# EAGLE design nola6 (EAGLE 8.7.1)
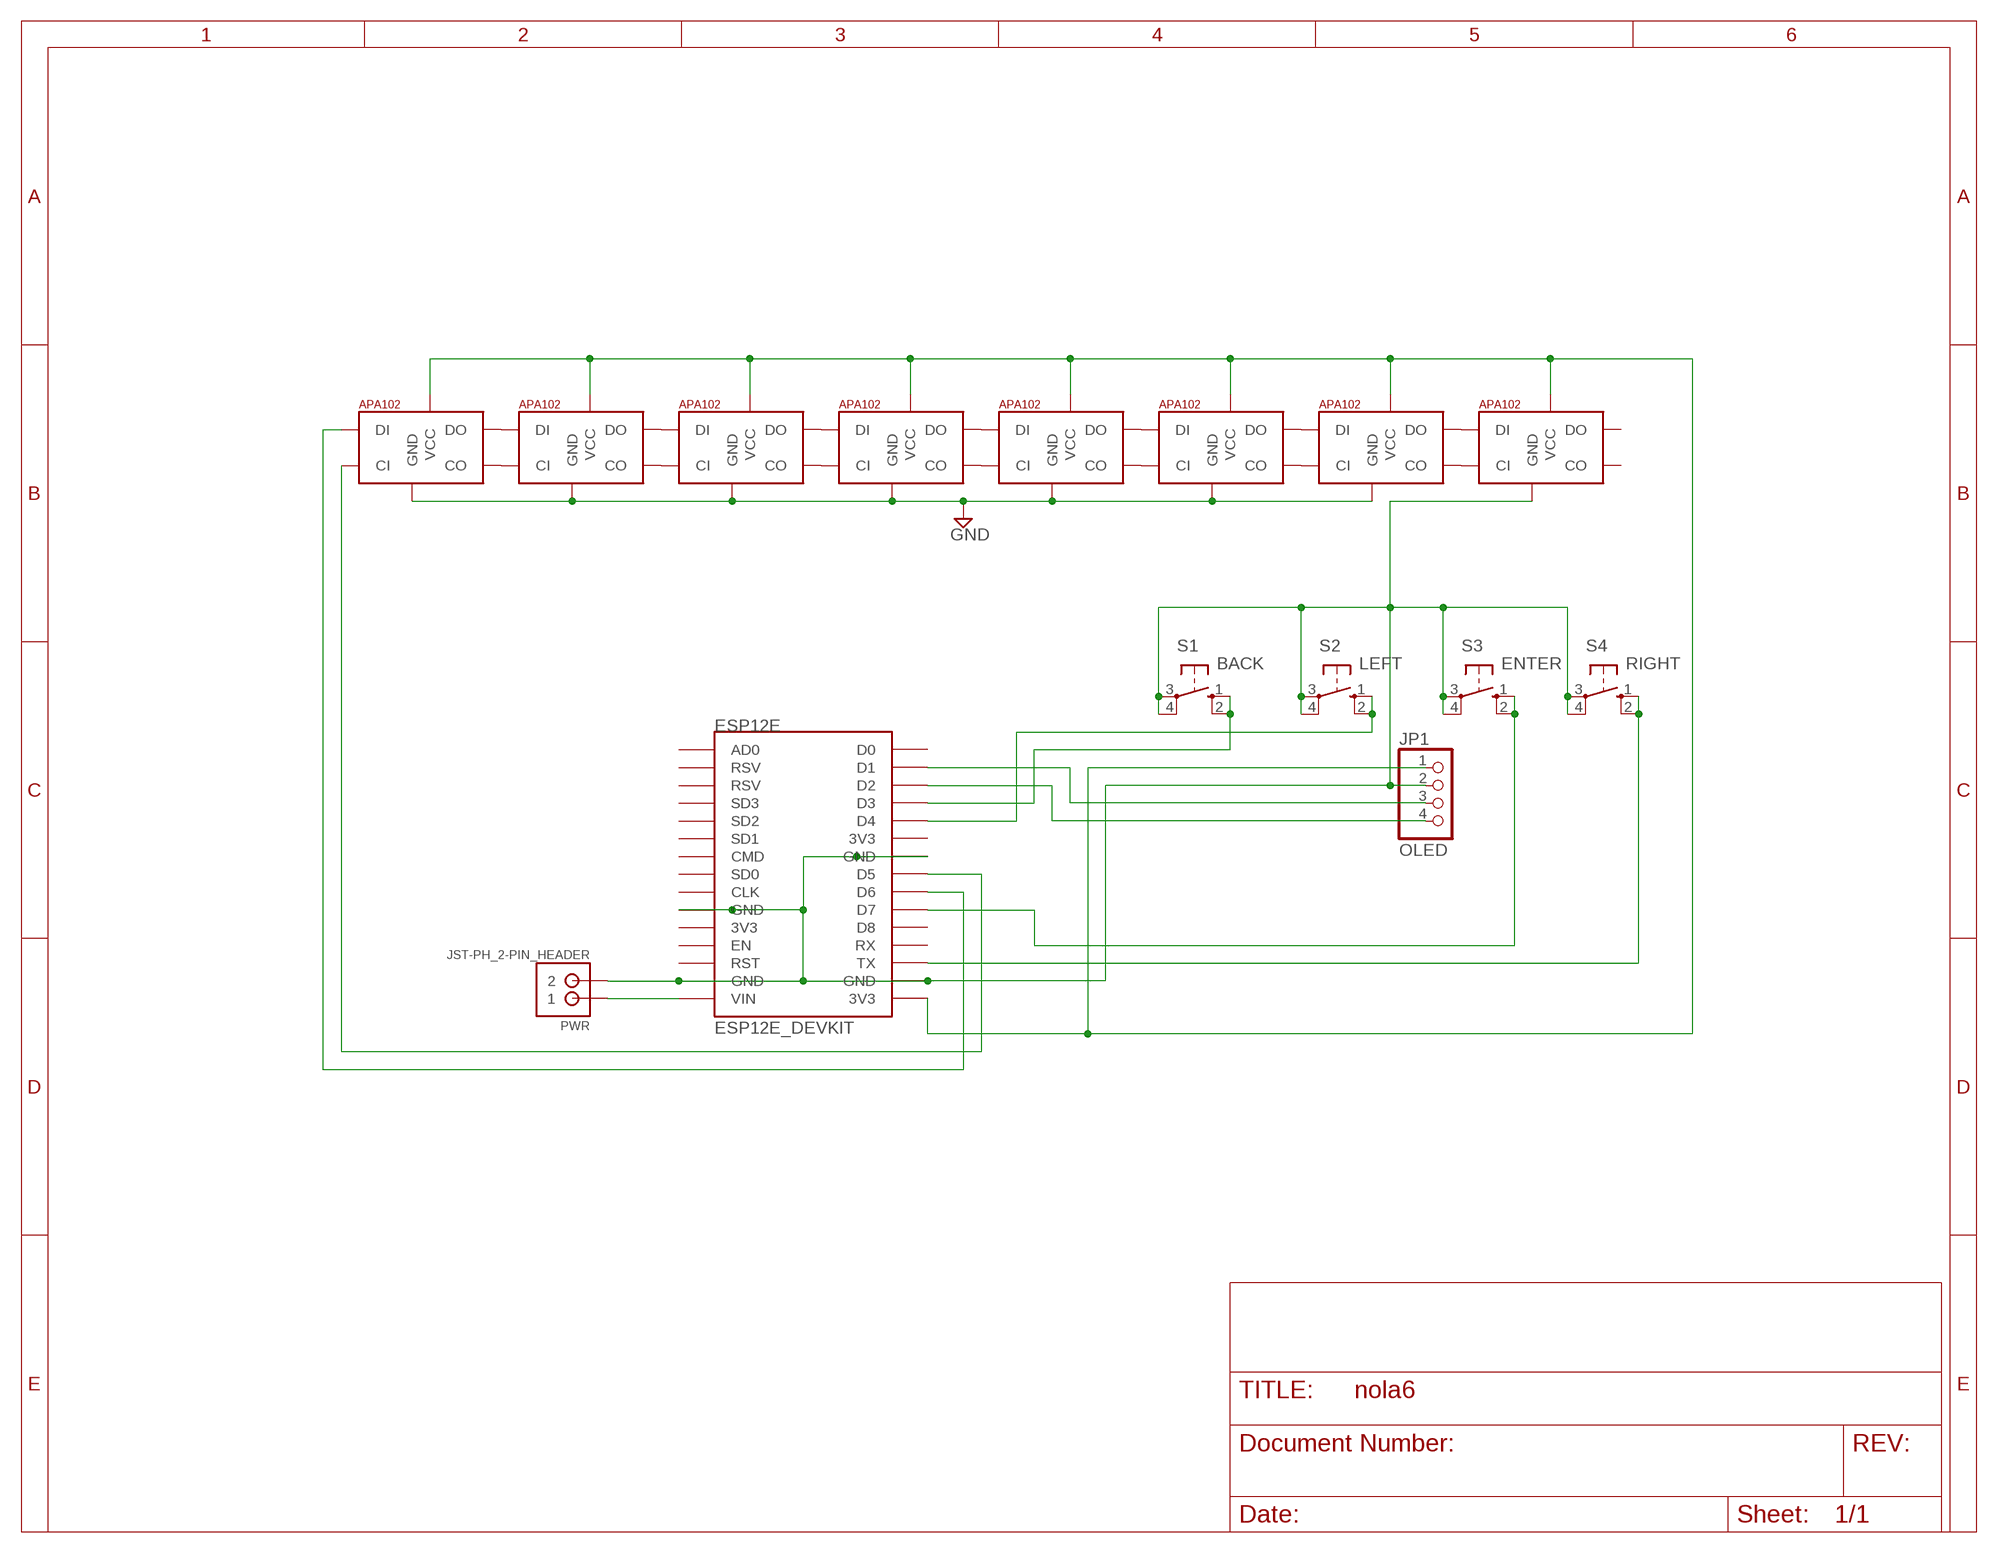
[diagram p0: schematic, sheet 1]

## Parts
ESP12E  ESP12E_DEVKIT  [ESP12E_DEVKIT]
JP1  OLED  PINHD-1X4  [1X04]
LED1  APA1025050  [APA102_5050]
LED2  APA1025050  [APA102_5050]
LED3  APA1025050  [APA102_5050]
LED4  APA1025050  [APA102_5050]
LED5  APA1025050  [APA102_5050]
LED6  APA1025050  [APA102_5050]
LED7  APA1025050  [APA102_5050]
LED8  APA1025050  [APA102_5050]
PWR  JST-PH_2-PIN_HEADER  [JST_B2B-PH_HEADER]
S1  BACK  10-XX  [B3F-10XX]
S2  LEFT  10-XX  [B3F-10XX]
S3  ENTER  10-XX  [B3F-10XX]
S4  RIGHT  10-XX  [B3F-10XX]

## Nets
GND: ESP12E.GND@0(GND) ESP12E.GND@1(GND) ESP12E.GND@2(GND) ESP12E.GND@3(GND) JP1.2 LED1.6(GND) LED2.6(GND) LED3.6(GND) LED4.6(GND) LED5.6(GND) LED6.6(GND) LED7.6(GND) LED8.6(GND) PWR.P2 S1.3(P) S1.4(P1) S2.3(P) S2.4(P1) S3.3(P) S3.4(P1) S4.3(P) S4.4(P1)
N$1: LED1.3(DO) LED2.4(DI)
N$2: LED1.2(CO) LED2.5(CI)
N$3: LED2.3(DO) LED3.4(DI)
N$4: LED2.2(CO) LED3.5(CI)
N$5: LED3.3(DO) LED4.4(DI)
N$6: LED3.2(CO) LED4.5(CI)
N$7: LED4.3(DO) LED5.4(DI)
N$8: LED4.2(CO) LED5.5(CI)
N$9: LED5.3(DO) LED6.4(DI)
N$10: LED5.2(CO) LED6.5(CI)
N$11: LED6.3(DO) LED7.4(DI)
N$12: LED6.2(CO) LED7.5(CI)
N$13: LED7.3(DO) LED8.4(DI)
N$14: LED7.2(CO) LED8.5(CI)
N$15: ESP12E.D1 JP1.3
N$16: ESP12E.3V3@2(3V3) JP1.1 LED1.1(VCC) LED2.1(VCC) LED3.1(VCC) LED4.1(VCC) LED5.1(VCC) LED6.1(VCC) LED7.1(VCC) LED8.1(VCC)
N$17: ESP12E.D2 JP1.4
N$19: ESP12E.D6 LED1.4(DI)
N$20: ESP12E.D5 LED1.5(CI)
N$22: ESP12E.D3 S1.1(S) S1.2(S1)
N$23: ESP12E.D4 S2.1(S) S2.2(S1)
N$24: ESP12E.D7 S3.1(S) S3.2(S1)
N$25: ESP12E.TX S4.1(S) S4.2(S1)
N$27: ESP12E.VIN PWR.P1
Unconnected: ESP12E.3V3@0(3V3) ESP12E.3V3@1(3V3) ESP12E.AD0 ESP12E.CLK ESP12E.CMD ESP12E.D0 ESP12E.D8 ESP12E.EN ESP12E.RST ESP12E.RSV@0(RSV) ESP12E.RSV@1(RSV) ESP12E.RX ESP12E.SD0 ESP12E.SD1 ESP12E.SD2 ESP12E.SD3 LED8.2(CO) LED8.3(DO)

## Library data of the parts
ESP12E = ESP12E_DEVKIT:ESP12E_DEVKIT: ESP12E DEVKIT BOARD
JP1 = pinhead:PINHD-1X4: PIN HEADER
LED1-LED8 = jos-ph:APA102: APA102C 5050 RGB LED -- Adafruit DotStar Single LED Pixel Product Page: https://www.adafruit.com/products/2343 Datasheet: https://cdn-shop.adafruit.com/product-files/2343/APA102C.pdf
PWR = SRG:JST-PH_2-PIN_HEADER: 2-pin JST PH Shrouded Header, top entry P/N B2B-PH-K-S Mating connector PHR-2 Mating cable assembly: Sparkfun PRT-09914 <http://www.sparkfun.com/products/9914>
S1-S4 = switch-omron:10-XX: OMRON SWITCH; MPN: B3F-1000; OC_FARNELL: 176432; OC_NEWARK: 36M3542

## Board
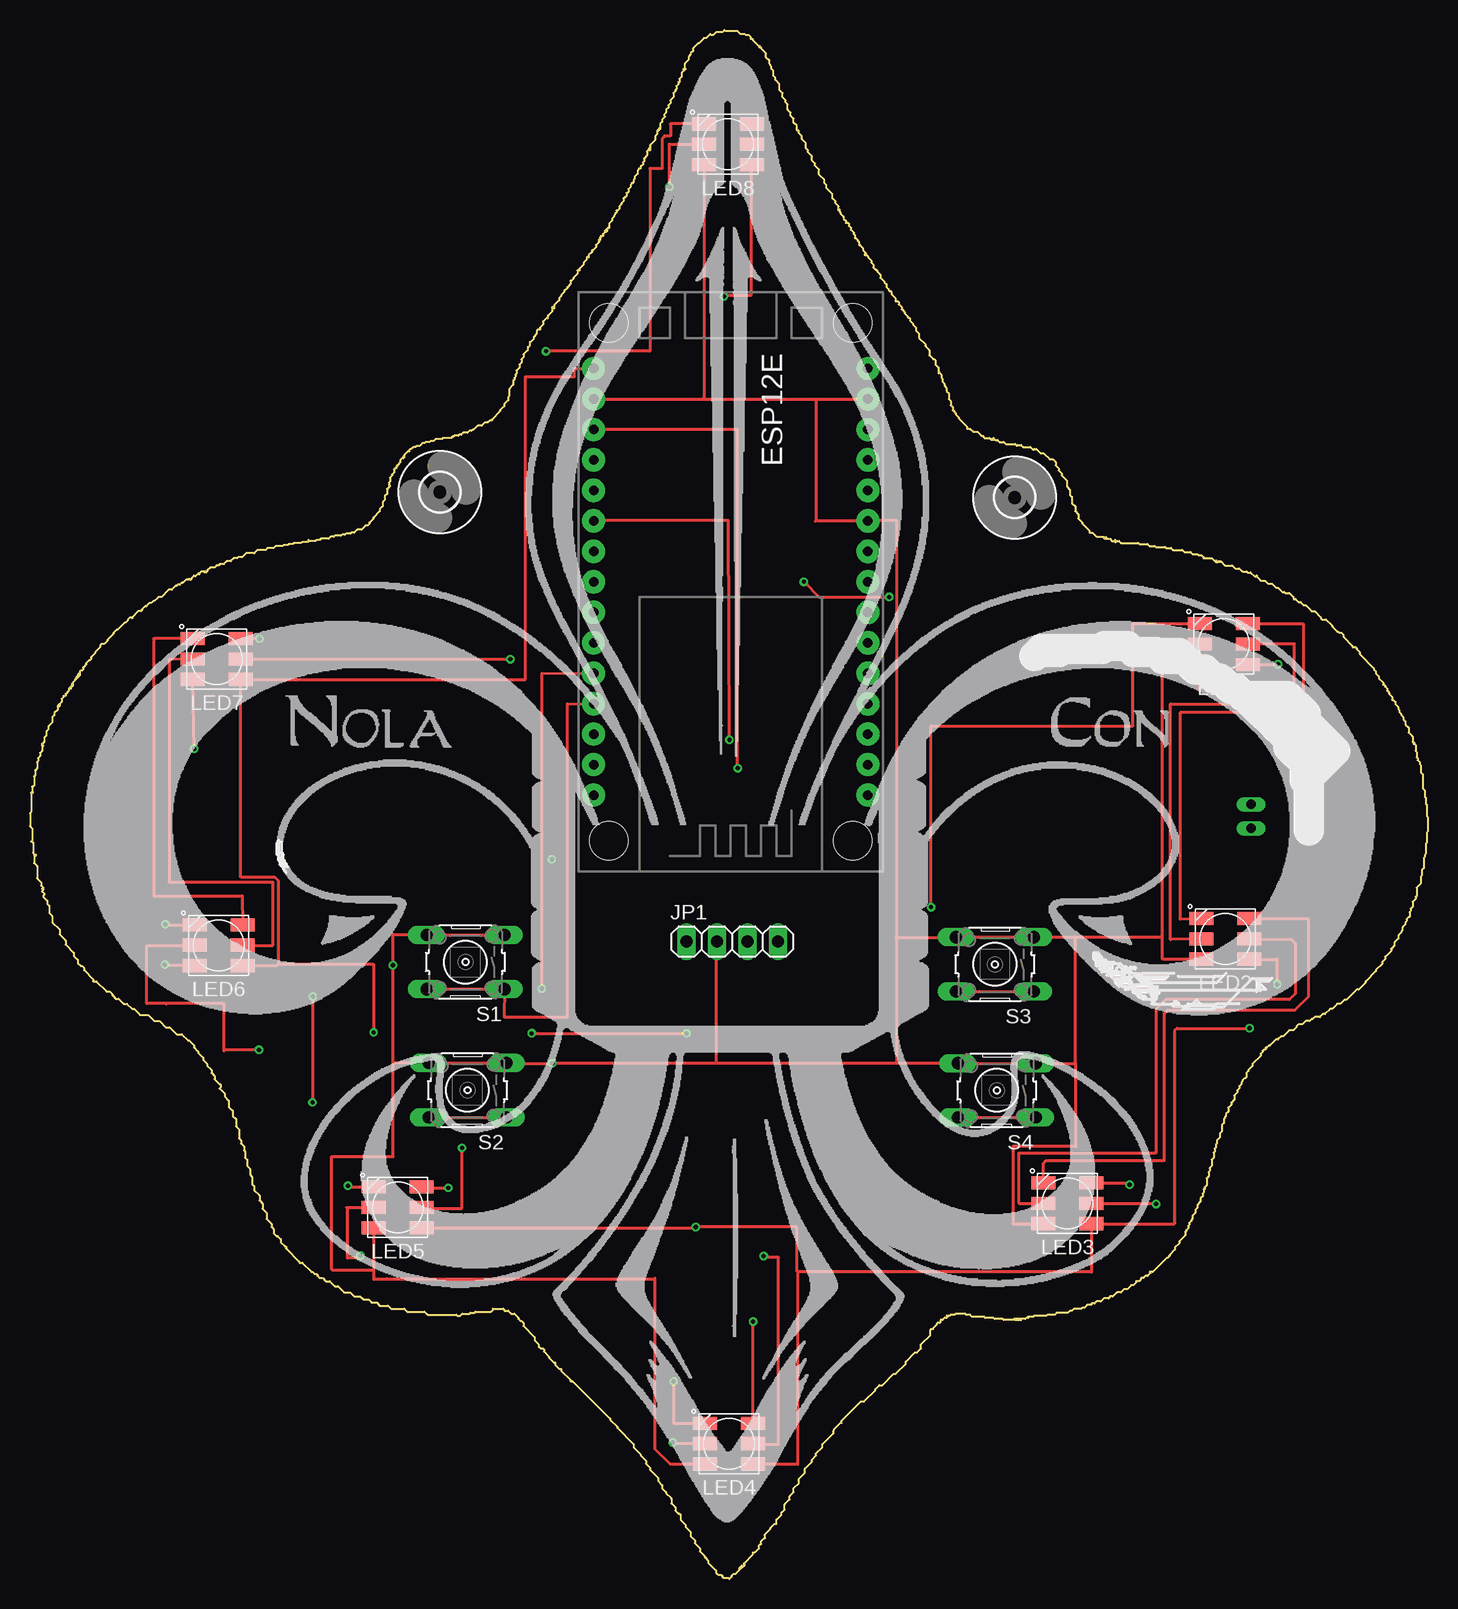
[diagram p1: board, top side]
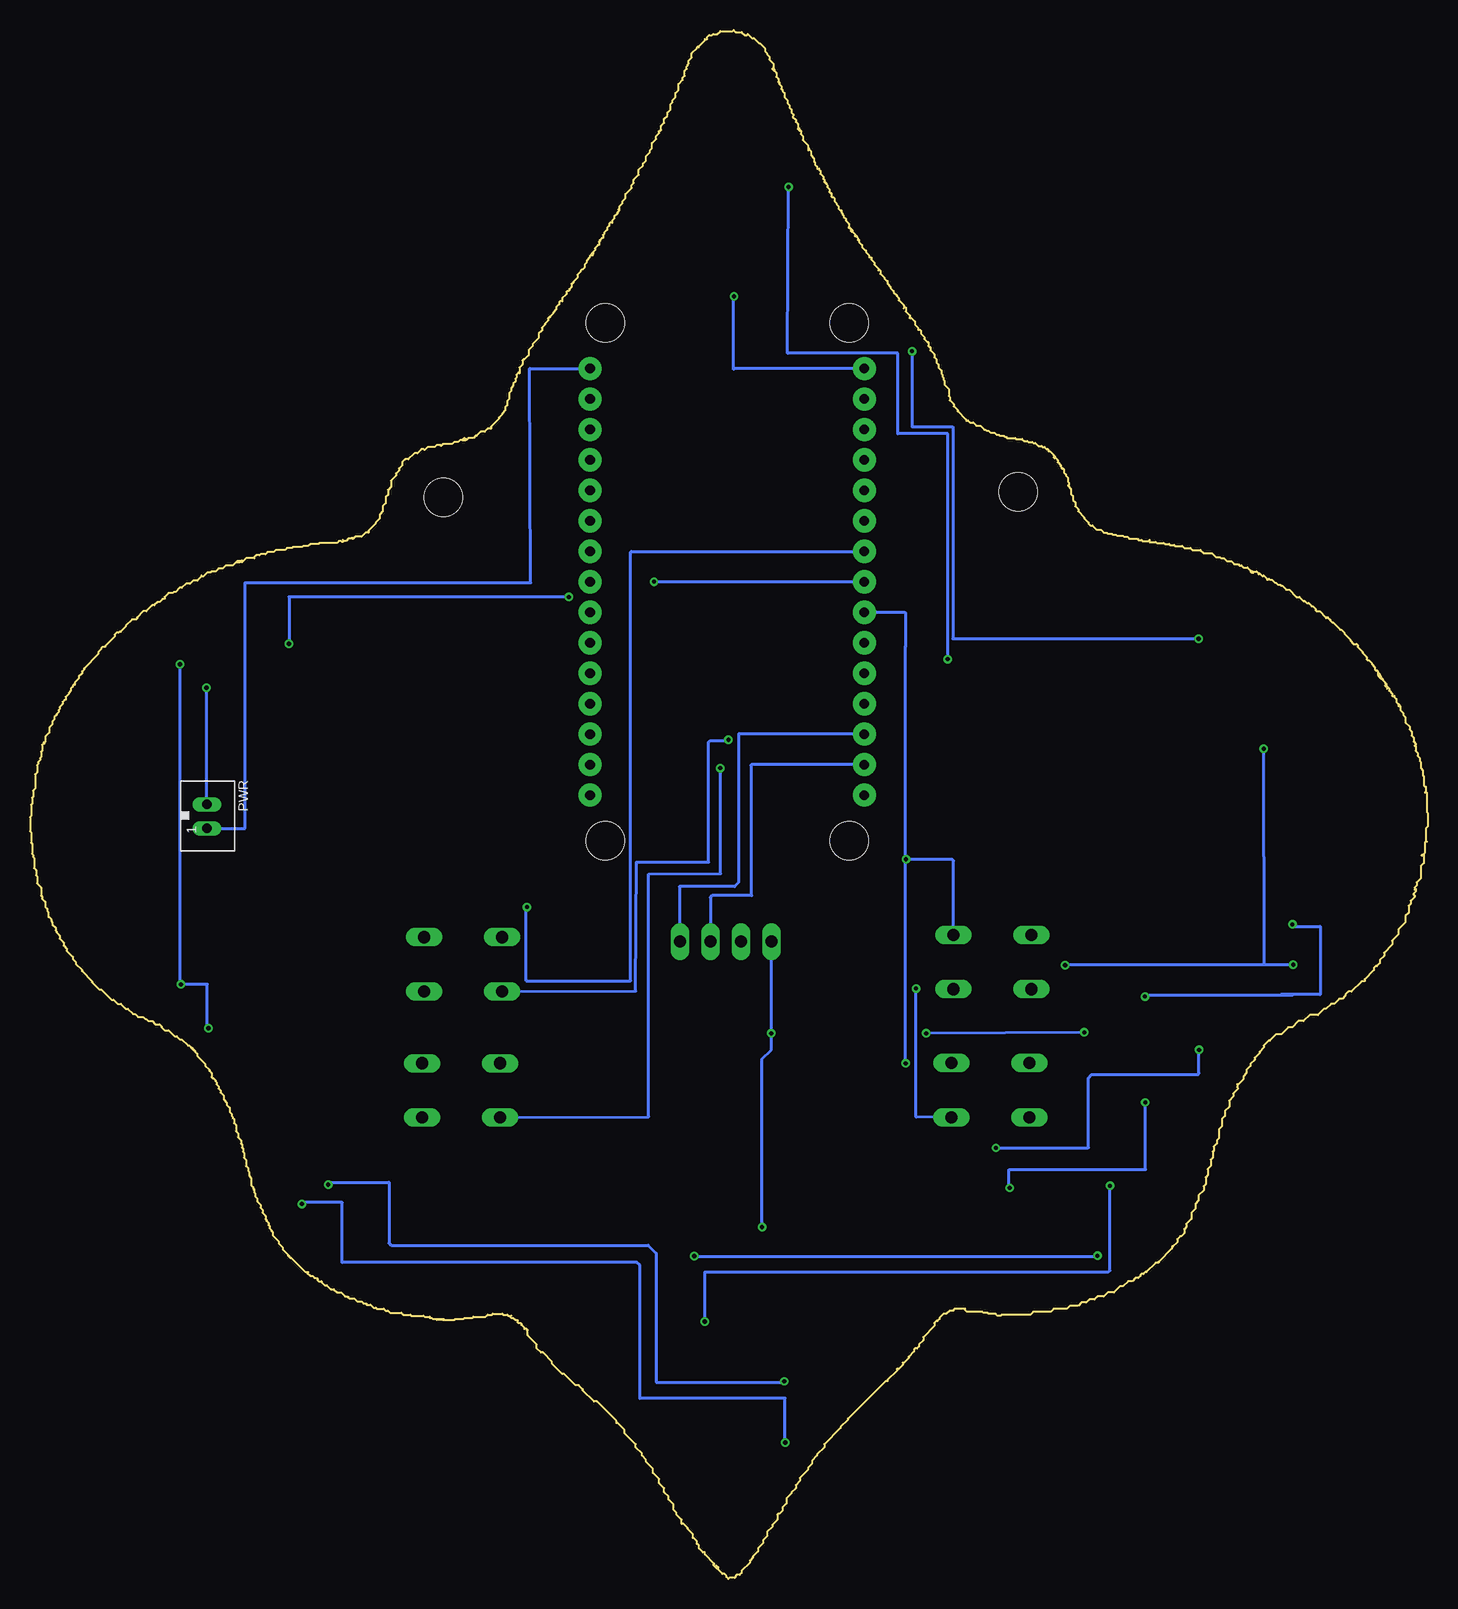
[diagram p2: board, bottom side, seen from below]

Size 116.53 x 129.12 mm. Coordinates in mm from the lower left corner, seen from the top.
Outline: 67.49,114.16 67.49,113.98 67.57,113.9 67.57,113.81 67.83,113.56 67.83,113.39 68,113.22 68,113.05 68.17,113.05 68.25,112.97 68.25,112.8 68.43,112.62 68.43,112.45 68.68,112.2 68.68,112.11 68.77,112.03 68.77,111.78 68.85,111.78 69.02,111.61 69.02,111.52 69.1,111.44 69.1,111.18 69.19,111.18 69.44,110.92 69.44,110.75 69.62,110.58 69.62,110.41
Outline: 69.62,110.33 69.62,110.41
Outline: 69.62,110.41 69.7,110.5 69.7,110.33 69.78,110.33 69.87,110.25 69.87,110.16 70.12,109.91 70.12,109.73 70.29,109.56 70.29,109.31 70.47,109.14 70.55,109.14 70.63,109.05 70.63,108.97 70.89,108.72 70.89,108.46 71.23,108.12 71.23,108.03 71.31,107.95 71.4,107.95 71.4,107.69 71.57,107.53 71.57,107.44 71.66,107.36 71.74,107.36 71.82,107.27 71.82,107.1 72.16,106.76 72.16,106.5 72.34,106.5 72.42,106.42 72.42,106.25 72.68,106 72.68,105.83 72.93,105.57 72.93,105.48 73.19,105.23 73.19,105.14 73.27,105.14 73.35,105.06 73.35,104.89 73.61,104.64 73.61,104.55 73.87,104.3 73.87,104.04 74.12,103.78 74.12,103.44 74.63,102.94 74.63,102.77 74.97,102.42 74.97,102 75.31,101.66 75.4,101.66 75.48,101.58 75.48,101.23 75.74,100.98 75.74,100.47 75.82,100.55 75.99,100.39 75.99,100.13 76.07,100.05 76.07,99.79 76.25,99.62 76.25,99.45 76.41,99.28 76.41,99.03 76.59,98.86 76.59,98.34 76.75,98.17 76.75,97.83 76.93,97.66 76.93,97.41 77.18,97.16 77.18,97.07 77.44,96.81 77.44,96.73 78.12,96.05 78.12,95.88 78.37,95.88 78.62,95.62 78.97,95.62 79.31,95.28 79.39,95.28 79.56,95.11 79.99,95.11 80.16,94.94 80.32,95.11 80.5,94.94
Outline: 80.5,94.94 80.24,94.94 80.16,95.03
Outline: 80.5,94.94 80.66,94.94 80.84,94.78 81.18,94.78 81.34,94.61 82.11,94.61 82.28,94.44 82.28,94.52 82.62,94.52 82.79,94.35 83.38,94.35 83.64,94.09 83.72,94.18 83.9,94.18 84.24,93.84 84.49,93.84 85,93.33 85.25,93.33 85.51,93.08 85.51,92.82 85.77,92.56 85.77,92.39 86.02,92.14 86.02,91.97 86.44,91.55 86.44,91.03 86.7,90.78 86.7,90.36 86.87,90.19 86.87,89.67 87.12,89.42 87.12,89 87.38,88.74 87.38,88.4 87.72,88.06 87.72,87.97 88.31,87.38 88.31,87.21 88.57,87.21 88.91,86.87 89.42,86.87 89.5,86.78
Outline: 89.68,86.7 89.59,86.7 89.5,86.78
Outline: 89.68,86.7 89.76,86.78 89.5,86.78
Outline: 89.68,86.7 90.02,86.7 90.19,86.53 90.35,86.53 90.44,86.61 90.44,86.44 90.53,86.44 90.61,86.53 90.78,86.53 90.95,86.36 92.4,86.36 92.48,86.28 93.16,86.28 93.33,86.11 93.75,86.11 93.84,86.02 94.6,86.02 94.69,85.94 95.12,85.94 95.28,85.77 96.05,85.77 96.22,85.59 96.73,85.59 96.9,85.42 97.32,85.42 97.41,85.34 97.66,85.34 97.84,85.17 97.84,85.08 98.52,85.08 98.85,84.75 99.03,84.75
Outline: 99.37,84.75 99.03,84.75
Outline: 99.03,84.75 98.94,84.83
Outline: 98.85,84.91 98.94,84.83
Outline: 98.94,84.83 99.28,84.83 99.62,84.49 100.22,84.49 100.47,84.23 100.81,84.23 101.06,83.98 101.41,83.98 101.49,83.89 101.75,83.89 102.09,83.55 102.17,83.55 102.25,83.64 102.25,83.55 102.59,83.22 102.94,83.22 103.19,82.96 103.53,82.96 103.87,82.62 104.04,82.62 104.38,82.28 104.55,82.28 104.63,82.19 104.97,82.19 105.31,81.86 105.31,81.69 105.49,81.69 105.74,81.43 105.91,81.43 106.16,81.17 106.34,81.17 106.84,80.66 107.1,80.66 107.61,80.16 107.61,80.07 107.69,79.98 108.03,79.98 108.54,79.47 108.54,79.39 108.97,78.97 109.06,78.97 109.14,78.88 109.31,78.88 109.48,78.71 109.48,78.54 110.25,77.78 110.25,77.69 110.5,77.69 110.59,77.61 110.59,77.52 110.84,77.27 110.84,77.09 112.03,75.91 112.03,75.82 112.2,75.65 112.2,75.48 112.46,75.22 112.46,75.05 112.79,74.72 112.79,74.55 112.88,74.55 112.97,74.46 112.97,74.38 113.13,74.2 113.13,74.03 113.31,73.86 113.31,73.78 113.56,73.53 113.56,73.27 113.65,73.27 113.81,73.1 113.81,72.93 114.07,72.67 114.07,72.5 114.16,72.42 114.16,72.25 114.32,72.08 114.32,72 114.5,71.83 114.5,71.66 114.66,71.48 114.66,71.23 114.92,70.97 114.92,70.55 115.26,70.21 115.26,69.78 115.34,69.7 115.43,69.7 115.34,69.61 115.43,69.61 115.52,69.53 115.52,69.02 115.6,68.94 115.6,68.51 115.69,68.42 115.69,68.25 115.85,68.08 115.85,67.91 115.94,67.83 115.94,67.23 116.11,67.06 116.11,65.88 116.28,65.7 116.28,65.19 116.37,65.11 116.37,64.6 116.45,64.52 116.45,63.58 116.53,63.5 116.53,62.3 116.45,62.22 116.45,61.37 116.37,61.28 116.37,60.44 116.28,60.35 116.28,60.18 116.19,60.09 116.19,59.24 116.03,59.07 116.03,58.65 115.94,58.56 115.94,57.97 115.6,57.63 115.6,56.95 115.52,56.87 115.52,56.7 115.26,56.44 115.26,56.02 115.09,55.84 115.09,55.67 115,55.59 115,55.16 114.92,55.16 114.75,54.99 114.75,54.82 114.66,54.74 114.66,54.57 114.41,54.31 114.41,54.06 114.32,53.98 114.32,53.89 114.07,53.63 114.07,53.38 113.73,53.04 113.73,52.78 113.47,52.53 113.47,52.36 112.97,51.85 112.97,51.68 112.71,51.42 112.71,51.25 112.2,50.74 112.2,50.66 111.35,49.81 111.35,49.73 110.75,49.13 110.59,49.13 109.74,48.28 109.56,48.28 109.22,47.94 108.97,47.94 108.54,47.52 108.38,47.52 107.95,47.09 107.78,47.09 107.53,46.84 107.1,46.84 106.93,46.66 106.84,46.66 106.68,46.49 106.34,46.49 106.08,46.24 105.74,46.24 105.57,46.07 105.57,45.98 105.31,45.73 104.97,45.73 104.47,45.22 104.29,45.22 104.04,44.96 103.87,44.96 103.36,44.45 103.28,44.45 103.1,44.28 103.02,44.28 103.02,44.2 102.94,44.12 102.85,44.12 102.77,44.03 102.77,43.95 102.59,43.77 102.59,43.6 101.91,42.92 101.91,42.75 101.57,42.41 101.57,42.33 101.41,42.16 101.41,41.82 101.32,41.73 101.24,41.73 101.06,41.56 101.06,41.48 100.98,41.39 100.98,41.23 100.81,41.05 100.81,40.88 100.64,40.71 100.64,40.55 100.38,40.29 100.38,39.95 100.13,39.7 100.13,39.52 99.88,39.27 99.88,38.93 99.71,38.76 99.71,38.59 99.62,38.5 99.62,38.42 99.53,38.34 99.53,37.99 99.37,37.82 99.37,37.31 99.19,37.14 99.19,36.8 98.94,36.55 98.94,36.3 98.85,36.21 98.85,35.95 98.77,35.87 98.77,35.62 98.69,35.53 98.69,35.1 98.52,34.94 98.52,34.42 98.34,34.25 98.34,34 98.26,33.91 98.26,33.57 98.09,33.41 98.09,32.81 97.92,32.64 97.92,32.47 97.84,32.47 97.84,32.21 97.75,32.13 97.75,31.88 97.58,31.7 97.58,31.45 97.32,31.2 97.32,30.94 97.16,30.77 97.16,30.52 96.9,30.26 96.9,30 96.81,29.92 96.81,29.84 96.65,29.66 96.65,29.49 96.56,29.41 96.56,29.24 96.39,29.07 96.39,28.98 96.31,28.9 96.31,28.64 95.79,28.13 95.79,27.96 95.46,27.62 95.46,27.45 95.03,27.03 95.03,26.95 94.94,26.95 94.94,26.86 94.86,26.77 94.78,26.77 93.59,25.58 93.33,25.58 93.41,25.5 93.16,25.24 92.99,25.24 92.82,25.07 92.65,25.07 92.56,24.99 92.56,24.9 92.48,24.82 92.22,24.82 92.22,24.73 91.97,24.48 91.8,24.48 91.46,24.14 91.21,24.14 90.95,23.88 90.61,23.88 90.27,23.54 90.02,23.54 90.02,23.46 89.93,23.38 89.5,23.38 89.25,23.12 88.91,23.12 88.74,22.95 88.49,22.95 88.49,22.86 88.15,22.86 87.89,22.61 87.72,22.61 87.63,22.52 87.04,22.52 86.87,22.36 86.7,22.36 86.53,22.18 85.59,22.18 85.43,22.02 84.83,22.02 84.75,21.93 83.72,21.93 83.64,21.84 83.22,21.84 83.22,21.76 83.04,21.76 82.96,21.67 82.03,21.67 82.11,21.59
Outline: 82.11,21.59 82.62,21.59
Outline: 82.11,21.59 81.18,21.59 81.09,21.67 80.41,21.67 80.32,21.76 79.65,21.76 79.56,21.84 78.54,21.84 78.37,22.02 78.03,22.02 77.94,22.1 77.18,22.1 77.09,22.02 76.75,22.02 76.67,21.93 76.41,21.93 76.5,21.84 76.41,21.76 76.25,21.76 76.07,21.59 75.91,21.59 75.91,21.42 75.82,21.33 75.65,21.33 75.56,21.25 75.56,21.16 75.31,20.91
Outline: 67.41,114.07 67.41,114.41 67.15,114.66 67.15,114.83 66.9,115.09 66.9,115.43 66.38,115.94 66.38,116.19 66.22,116.36 66.22,116.62 65.79,117.05 65.79,117.47 65.45,117.81 65.45,117.98 65.19,118.23 65.19,118.58 64.85,118.91 64.85,119.08 64.69,119.25 64.69,119.68 64.34,120.02 64.34,120.28 64.09,120.53 64.09,120.7 64,120.7 63.92,120.78 63.92,121.12 63.66,121.38 63.66,121.72 63.41,121.97 63.41,122.23 63.15,122.48 63.15,122.91 62.99,123.08 62.99,123.25 62.73,123.5 62.73,123.84 62.48,124.1 62.48,124.61 62.13,124.95 62.13,125.12 61.96,125.29 61.96,125.72 61.79,125.88 61.79,126.06 61.71,126.14 61.71,126.22 61.63,126.31 61.63,126.56 61.37,126.82 61.37,127.16 60.95,127.59 60.95,127.67
Outline: 60.77,127.67 60.86,127.75 60.77,127.75 60.27,128.26 60.27,128.35 60.1,128.35 60.1,128.52 59.93,128.69 59.67,128.69 59.59,128.78 59.24,128.78 58.99,129.03 57.97,129.03 57.88,129.12 57.71,128.94 57.21,128.94 56.95,128.69 56.78,128.69 56.7,128.78 56.35,128.44 56.18,128.44 55.76,128.01 55.68,128.01 55.25,127.59 55.25,127.33 55.08,127.16 55.08,127.07 54.91,126.91 54.91,126.65 54.57,126.31 54.57,125.97 54.66,125.88 54.57,125.8 54.48,125.8
Outline: 54.48,125.8 54.48,125.88
Outline: 54.48,125.8 54.48,125.72 54.31,125.54 54.31,125.21 54.15,125.03 54.15,124.78 54.06,124.78 54.06,124.61 53.89,124.44 53.89,124.19 53.8,124.1 53.8,124.02 53.63,123.84 53.63,123.5 53.38,123.25 53.38,123 53.21,122.83 53.21,122.66 53.04,122.48 53.04,122.23 52.87,122.06 52.87,121.97 52.95,121.89 52.7,121.64 52.7,121.47 52.53,121.3 52.53,120.87 52.45,120.78
Outline: 52.36,120.7 52.45,120.78
Outline: 52.45,120.78 52.45,120.87
Outline: 52.45,120.95 52.45,120.87
Outline: 52.45,120.87 52.27,120.7 52.27,120.44 52.11,120.28 52.11,119.94 51.68,119.51 51.68,119.08 51.59,119.17
Outline: 51.59,119.25 51.59,119.17
Outline: 51.59,119.17 51.43,119 51.43,118.66 51.17,118.41 51.17,118.15 51.09,118.06 51.09,117.89 50.91,117.72 50.91,117.55 50.74,117.55 50.74,117.47 50.66,117.39 50.66,117.13 50.41,116.88 50.41,116.7 50.32,116.62 50.32,116.45 50.23,116.36 50.15,116.36 50.15,116.28 50.06,116.19 50.06,116.03 49.9,115.86 49.9,115.6 49.81,115.52 49.73,115.52 49.73,115.26 49.64,115.17 49.55,115.17 49.47,115.09 49.47,114.83 49.3,114.66 49.3,114.58 49.13,114.41 49.13,114.24 48.96,114.07 48.88,114.07 48.88,113.9 48.79,113.81 48.79,113.73 48.7,113.64 48.7,113.56 48.54,113.39 48.54,113.22 48.28,112.97 48.28,112.71
Outline: 48.28,112.71 48.11,112.54
Outline: 48.11,112.54 48.11,112.37 48.02,112.28 47.94,112.28 47.94,112.37 48.11,112.54
Outline: 48.28,112.71 48.28,112.62 47.77,112.11 47.77,111.94 47.6,111.94 47.6,111.86 47.52,111.78 47.52,111.61 47.43,111.52
Outline: 47.43,111.52 47.43,111.61
Outline: 47.43,111.52 47.43,111.44 47.18,111.18 47.18,111.01 46.92,110.75 46.84,110.75 46.84,110.58 46.58,110.33 46.58,110.16 46.41,110.16 46.41,109.99 46.16,109.73 46.16,109.56 45.81,109.22 45.81,109.05 45.73,109.14 45.65,109.05 45.65,108.8 45.3,108.46 45.3,108.38 45.13,108.2 45.05,108.2 45.05,107.95 44.8,107.69 44.8,107.61 44.54,107.36 44.54,107.27 44.29,107.02 44.29,106.93 44.12,106.76 44.12,106.59 43.69,106.16 43.69,105.91 43.61,106 43.52,106 43.52,105.66 43.18,105.31 43.18,105.23
Outline: 43.18,105.06 43.18,105.23
Outline: 43.18,105.23 42.76,104.8 42.76,104.55 42.5,104.3 42.5,104.12 42.33,104.12 42.24,104.04 42.24,103.78 41.99,103.53 41.99,103.36 41.73,103.11 41.65,103.11 41.65,102.77 41.56,102.68 41.48,102.68 41.48,102.42 41.14,102.08 41.14,101.83 40.97,101.66 40.97,101.41 40.8,101.23 40.8,100.98 40.55,100.72 40.55,100.47 40.46,100.39 40.46,100.22 40.38,100.13 40.38,99.96 40.29,99.88 40.29,99.53 39.95,99.19 39.95,98.6 39.87,98.52 39.87,98.26 39.52,97.92 39.52,97.75 39.19,97.41 39.19,97.33 38.51,96.64 38.51,96.56 38.34,96.56 38.16,96.39 37.91,96.39 37.66,96.14 37.31,96.14 36.98,95.8 36.89,95.8 36.8,95.71 36.63,95.71 36.47,95.54 36.12,95.54 35.95,95.37 35.79,95.37 35.7,95.28 35.36,95.28 35.27,95.2 35.19,95.2 35.11,95.11 34.43,95.11 34.34,95.03 33.83,95.03 33.66,94.86 33.41,94.86 33.32,94.78 32.98,94.78 32.9,94.69 32.73,94.69 32.47,94.44 32.22,94.44 32.13,94.35 31.96,94.35 31.79,94.18 31.7,94.18 31.62,94.09 31.62,94.01 31.54,94.01 31.2,93.67 31.2,93.5 31.11,93.41 31.11,93.5
Outline: 31.11,93.58 31.11,93.5
Outline: 31.11,93.5 30.86,93.25 30.86,93.08 30.6,92.82 30.6,92.73 30.52,92.65 30.52,92.56 30.43,92.56 30.34,92.48 30.34,92.22 30.18,92.05 30.18,91.97 30.01,91.8 30.01,91.46 29.92,91.38 29.92,91.2 30.01,91.12 29.75,90.86 29.75,90.44 29.58,90.27 29.58,89.93 29.41,89.76 29.41,89.42 29.16,89.16 29.16,89 28.65,88.48 28.65,88.4 28.3,88.06 28.3,87.97 28.13,87.8 27.97,87.8 27.62,87.47 27.29,87.47 27.03,87.21 26.77,87.21 26.69,87.12 26.35,87.12 26.27,87.04 26.01,87.04 25.93,86.95 25.41,86.95 25.33,86.87 25.08,86.87 24.91,86.7 24.23,86.7 24.14,86.61 23.88,86.61 23.8,86.53 23.29,86.53 23.21,86.61 23.21,86.44 22.7,86.44 22.61,86.36 22.02,86.36 21.93,86.28 21.59,86.28 21.51,86.19 21.16,86.19 21.08,86.11 20.48,86.11 20.32,85.94 19.8,85.94 19.64,85.77 18.96,85.77 18.7,85.51 18.02,85.51 17.68,85.17 17.34,85.17 17.26,85.08 17,85.08 16.75,84.83 16.41,84.83 16.15,84.58 15.81,84.58 15.73,84.49 15.55,84.49 15.39,84.32 15.05,84.32 14.79,84.06 14.79,83.98
Outline: 14.79,83.98 14.71,83.89 14.54,83.89 14.62,83.98
Outline: 14.62,83.98 14.79,83.98
Outline: 14.62,83.98 14.28,83.98 14.11,83.81 14.11,83.72 14.03,83.81 13.77,83.55 13.69,83.64 13.43,83.39 13.43,83.3 13.35,83.3 13.26,83.39 13.18,83.3 13.01,83.3 12.75,83.05 12.66,83.05 12.5,82.88 12.32,82.88 12.24,82.79 12.16,82.79 11.82,82.45 11.56,82.45 10.96,81.86 10.71,81.86 10.37,81.52 10.29,81.52 10.12,81.34 9.95,81.34 9.69,81.09 9.61,81.09 9.35,80.83 9.35,80.75 9.27,80.66 9.01,80.66 8.5,80.16 8.5,80.07 8.41,80.16 8.33,80.16 8.16,79.98 8.16,79.9 7.99,79.73 7.91,79.73 7.31,79.14 7.23,79.14 6.97,78.88 6.97,78.8 6.46,78.28 6.46,78.2 6.21,77.94 5.95,77.94 5.87,77.86 5.87,77.69 5.44,77.27 5.44,77.18 5.1,76.84 5.1,76.67 5.02,76.58 4.93,76.58 4.68,76.33 4.68,76.25 4.42,75.99 4.42,75.82 4.34,75.73 4.25,75.73 4.17,75.65 4.17,75.31 4.08,75.31 4,75.39 4,75.14
Outline: 4,75.14 3.91,75.05
Outline: 4.08,75.48 4.08,75.22 4,75.14
Outline: 3.83,74.97 3.74,74.97 3.91,75.14
Outline: 3.91,75.14 3.91,75.22
Outline: 3.91,75.14 3.91,75.05
Outline: 3.91,75.05 3.83,74.97
Outline: 3.83,74.97 3.57,74.72 3.57,74.46 3.49,74.38 3.49,74.46
Outline: 3.49,74.63 3.49,74.46
Outline: 3.49,74.46 3.4,74.38 3.4,74.2 3.32,74.29 3.23,74.2 3.23,74.03 2.98,73.78 2.98,73.61 2.81,73.61 2.81,73.53 2.64,73.36 2.64,73.1 2.47,72.93 2.47,72.76 2.3,72.76
Outline: 2.38,72.84 2.3,72.76
Outline: 2.3,72.76 2.3,72.42 2.04,72.16 2.04,72 1.87,71.83 1.87,71.4 1.53,71.06 1.53,70.8 1.36,70.64 1.36,70.3 1.19,70.12 1.19,69.78 1.02,69.61 1.02,69.53 1.11,69.44 1.02,69.44 1.02,69.02 0.85,68.85 0.85,68.59 0.68,68.42 0.68,68.17 0.6,68.08 0.6,67.58 0.43,67.41 0.43,66.98 0.34,66.89 0.34,66.13 0.26,66.05 0.17,66.05 0.17,65.62
Outline: 0.26,65.53 0.17,65.62
Outline: 0.17,65.62 0.09,65.53 0.09,63.92 0,63.83 0,62.73 0.17,62.56 0.17,61.54 0.09,61.45 0.17,61.45 0.26,61.37 0.26,60.52 0.51,60.27 0.51,60.35 0.34,60.35 0.34,59.67 0.6,59.41 0.6,58.39 0.94,58.05 0.94,57.8 1.11,57.63 1.11,57.46 1.02,57.55 1.02,57.29 1.19,57.12 1.19,57.03 1.11,56.95 1.11,56.87 1.45,56.52 1.45,56.27 1.62,56.1 1.62,55.5 1.87,55.25 1.87,54.74 2.47,54.14 2.47,53.72 2.98,53.21 2.98,52.87 3.66,52.19 3.66,51.94 4,51.59 4,51.34 4.25,51.09 4.34,51.09 4.51,50.91 4.51,50.74 5.27,49.98 5.27,49.81 5.53,49.81 6.38,48.96 6.63,48.96 6.89,48.7 6.89,48.62 7.14,48.37 7.4,48.37 7.82,47.94 8.07,47.94 8.5,47.52 8.67,47.52 9.18,47 9.86,47 10.37,46.49 10.8,46.49 11.3,45.98 11.64,45.98 12.24,45.39 12.66,45.39 13.18,44.88 13.26,44.88 13.69,44.45 13.69,44.28 14.03,43.95 14.03,43.86 14.45,43.44 14.45,43.27 14.79,42.92 14.79,42.75 15.13,42.41 15.13,42.16 15.39,41.91 15.39,41.65 15.81,41.23 15.89,41.23 15.89,40.97 15.81,40.88 16.23,40.46 16.23,40.2 16.57,39.87 16.57,39.35 16.91,39.02 16.91,38.59 17.17,38.34 17.17,37.74 17.43,37.48 17.43,36.72 17.6,36.55 17.6,36.3 17.85,36.04 17.85,35.7 17.94,35.62 17.94,35.1 18.11,34.94 18.11,34.42 18.36,34.17 18.36,33.66 18.53,33.49 18.53,32.89 18.7,32.73 18.7,32.38 19.12,31.96 19.12,31.53 19.38,31.28 19.38,30.85 19.72,30.52 19.72,30 20.14,29.58 20.14,29.32 20.32,29.16 20.32,28.81 20.57,28.56 20.66,28.56 20.91,28.3 20.91,28.05 21.25,27.71 21.34,27.71 21.34,27.54 22.44,26.43 22.44,26.35 22.7,26.35 23.46,25.58 23.55,25.58 23.72,25.41 23.88,25.41 23.97,25.33 23.97,25.24 24.14,25.07 24.4,25.07 24.65,24.82 24.99,24.82 25.41,24.39 25.67,24.39 26.18,23.88 26.69,23.88 27.03,23.54 27.54,23.54 27.8,23.29 28.22,23.29 28.48,23.04 28.9,23.04 29.16,22.78 29.84,22.78 30.09,22.52 31.2,22.52 31.45,22.27 32.9,22.27 33.15,22.02 35.53,22.02 35.62,21.93 35.87,21.93 36.04,22.1 36.63,22.1 36.72,22.18 37.06,22.18 37.15,22.27 38.42,22.27 38.59,22.44 38.59,22.52 39.44,22.52 39.52,22.44
Outline: 39.52,22.36 39.87,22.36 40.12,22.1 40.38,22.1 40.72,21.76 40.72,21.67 40.88,21.5 40.97,21.5 41.14,21.33 41.14,21.08 42.08,20.14 42.08,19.89 42.41,19.55 42.41,19.38 42.59,19.21 42.76,19.21 42.84,19.12 42.84,18.95 43.27,18.53 43.27,18.45 43.69,18.02 43.77,18.02 43.77,17.85 44.12,17.51 44.29,17.51 44.29,17.34 45.05,16.57 45.05,16.49 45.22,16.49 48.37,13.35 48.37,13.26 48.96,12.67 48.96,12.58 50.32,11.22 50.32,10.96 50.91,10.37 50.91,10.29 51.34,9.86 51.34,9.61 51.68,9.27 51.68,9.1 52.36,8.42 52.36,8.16 52.7,7.82 52.7,7.57 53.04,7.23 53.04,7.14 53.47,6.71 53.47,6.29 53.8,5.95 53.8,5.7 54.06,5.44 54.15,5.44 54.23,5.36 54.23,4.93 54.66,4.51 54.66,4.34 55.08,3.91 55.08,3.57 55.42,3.23 55.42,2.98 55.85,2.55 55.85,2.3 56.27,1.87 56.27,1.79 56.52,1.53 56.52,1.36 57.21,0.68 57.21,0.51 57.38,0.34 57.63,0.34 57.71,0.26 57.71,0.17 57.8,0.09 58.23,0.09 58.31,0 58.48,0.17 58.48,0.26 58.65,0.43 58.82,0.43 59.16,0.77 59.16,0.94 59.33,1.1 59.33,0.94
Outline: 59.33,0.94 59.24,0.85
Outline: 59.33,0.94 59.59,1.19 59.5,1.19 59.5,1.27 60.27,2.04 60.27,2.21 60.43,2.21 60.77,2.55 60.77,2.81 60.86,2.89 60.95,2.89 60.95,3.15 61.2,3.4 61.29,3.4 61.29,3.74 61.71,4.17 61.71,4.25 62.05,4.59 62.22,4.59 62.22,4.93 62.65,5.36 62.65,5.53 62.9,5.78 62.9,6.21 63.32,6.63 63.32,6.88 63.66,7.23 63.66,7.57 64.09,7.99 64.09,8.33 64.6,8.84 64.6,9.18 65.19,9.78 65.19,9.95 65.53,10.29 65.53,10.46 66.04,10.96 66.04,11.22 66.98,12.16 66.98,12.33
Outline: 66.98,12.41 67.57,13.01 67.66,13.01 67.66,13.17 69.28,14.79 69.53,14.79 70.47,15.72 70.47,15.81 70.81,16.15 71.06,16.15 72,17.08 72.16,17.08 73.02,17.93 73.02,18.11 73.78,18.87 73.95,18.87 74.29,19.21 74.29,19.55 75.06,20.31 75.06,20.74 75.14,20.82 75.31,20.82
Copper layers (1*16): Top 0.0356mm / dielectric 1.5011mm / Bottom 0.0356mm
Design rules "osh": minimum track width 6mil, minimum drill 13mil, track to track 6mil, track to pad 6mil, pad to pad 6mil, via to via 6mil, smd to smd 6mil, copper to edge 15mil, drill to drill 6mil, minimum pad ring 7mil, minimum via ring 7mil, stop-mask expansion 4mil, vias tented up to drill 0mil, thermal gap 10mil

### Footprints (pad centres in the part's own frame; a part is rotated, then mirrored left to right if it is on the bottom)
ESP12E_DEVKIT = drill 0.8 pad 1.93: 3V3@0 -11.43,-7.62; 3V3@1 11.43,5.08; 3V3@2 11.43,-17.78; AD0 -11.43,17.78; CLK -11.43,-2.54; CMD -11.43,2.54; D0 11.43,17.78; D1 11.43,15.24; D2 11.43,12.7; D3 11.43,10.16; D4 11.43,7.62; D5 11.43,0; D6 11.43,-2.54; D7 11.43,-5.08; D8 11.43,-7.62; EN -11.43,-10.16; GND@0 -11.43,-5.08; GND@1 -11.43,-15.24; GND@2 11.43,2.54; GND@3 11.43,-15.24; RST -11.43,-12.7; RSV@0 -11.43,15.24; RSV@1 -11.43,12.7; RX 11.43,-10.16; SD0 -11.43,0; SD1 -11.43,5.08; SD2 -11.43,7.62; SD3 -11.43,10.16; TX 11.43,-12.7; VIN -11.43,-17.78 | hole 3.2: -10.16,21.59; 10.16,21.59; 10.16,-21.59; -10.16,-21.59
1X04 = drill 1.016 long: 1 -3.81,0; 2 -1.27,0; 3 1.27,0; 4 3.81,0
APA102_5050 = smd 2 x 1.1: 1 2,-1.7; 2 2,0; 3 2,1.7; 4 -2,1.7; 5 -2,0; 6 -2,-1.7
JST_B2B-PH_HEADER = drill 0.8 long: P1 1.075,0.048; P2 -0.925,0.048
B3F-10XX = drill 1.016 long: 1 -3.251,2.261; 2 3.251,2.261; 3 -3.251,-2.261; 4 3.251,-2.261
3,2 = hole 3.2: 0,0

### Placement (x,y rotation side)
ESP12E  58.41,83.11 180 top
JP1  58.53,53.12 0 top
LED1  99.53,77.93 0 top
LED2  99.64,53.35 0 top
LED3  86.49,31.31 0 top
LED4  58.27,11.28 0 top
LED5  30.67,30.97 0 top
LED6  15.72,52.82 0 top
LED7  15.57,76.69 0 top
LED8  58.18,119.59 0 top
PWR  101.84,63.64 270 bottom
S1  36.3,51.42 180 top
S2  36.47,40.74 180 top
S3  80.44,51.23 180 top
S4  80.59,40.73 180 top
U$1  [3,2]  34.17,90.6 0 top
U$2  [3,2]  82.09,90.15 0 top

### Tracks (layer width: path | path; a pad name or v marks a point on that pad's centre or on a via)
GND  (via drill 0.35)
  Top 0.152: 57.24,42.99 57.2,43.03
  Top 0.254: 30.25,43 v30.25,51.16 30.25,53.73 30.29,53.68 S1.4 S1.3 | 30.25,43 30.25,35.2 30.27,35.18 25.13,35.18 25.13,25.81 25.21,25.73 28.67,25.73 | 29.75,25.02 29.76,25.02 | 29.76,25.02 52.04,25.02 52.08,25.06 52.08,10.86 53.36,9.58 LED4.6 | LED5.6 28.67,25.73 | 28.67,25.73 28.67,24.98 28.68,24.97 28.73,25.02 29.76,25.02 | LED6.6 11.23,51.12 v11.23,51.19 | v13.69,69.2 LED7.6 | LED2.6 94.45,51.65 94.38,51.71 94.38,53.43 | 94.38,53.43 94.38,76.06 94.54,76.21 97.51,76.21 | 97.51,76.21 LED1.6 | S4.3 85.64,42.98 | 85.64,42.98 87.15,42.98 | 87.15,42.98 87.15,36.09 87.19,36.05 81.93,36.05 81.93,29.59 84.47,29.59 LED3.6 | 87.15,42.98 87.15,53.47 87.1,53.52 87.07,53.49 | 87.07,53.49 94.32,53.49 94.38,53.43 | 57.24,42.99 43.55,42.99 | 43.55,42.99 v43.54,42.97 | 43.55,42.99 S2.3 arc-90 S2.3 S2.4 30.25,43 | 56.63,117.44 LED8.6 56.18,98.45 56.27,98.36 | 87.07,53.49 S3.3 S3.4 77.16,53.46 72.16,53.46 72.25,53.38 | 85.64,42.98 S4.3 S4.4 72.25,42.99 | 57.24,42.99 57.24,53.1 JP1.2 | 97.51,76.21 97.51,74.22 | 97.51,74.22 97.5,74.2 | 97.51,74.22 97.58,74.29 v101.83,74.29 | 72.25,42.99 57.24,42.99 | 72.25,42.99 72.25,53.38 | 72.25,53.38 72.25,88.23 69.88,88.23 | 69.88,88.23 ESP12E.GND@0 | ESP12E.GND@3 56.27,98.36 | 56.27,98.36 65.53,98.36 | 65.53,98.36 ESP12E.GND@1 | 65.53,98.36 65.53,88.23 | 65.45,88.14 65.53,88.23 | 65.53,88.23 69.88,88.23
  Bottom 0.203: 43.56,77.73 43.54,77.7
  Bottom 0.254: v11.23,51.19 13.65,51.19 | 13.65,51.19 30.25,51.19 v30.25,51.16 | 13.65,51.19 v13.69,69.2 | v43.54,42.97 43.54,59.96 | v43.52,59.98 v43.51,59.99 | 43.54,59.96 43.54,77.7 | S1.3 39.55,59.86 39.67,59.98 v43.52,59.98 | v43.52,59.98 43.54,59.96 | v101.83,74.29 101.83,64.61 PWR.P2 | ESP12E.GND@2 43.61,80.58 43.56,80.54 43.56,77.73
N$1
  Top 0.254: LED1.3 106.13,79.63 106.13,72.21 95.87,72.21 95.87,55.01 LED2.4
N$2
  Top 0.254: LED2.5 95.08,53.31 | 95.08,53.31 95.08,53.28 | 95.08,53.31 95.08,72.94 105.42,72.94 105.42,77.93 | 105.42,77.93 | 105.42,77.93 LED1.2
N$3
  Top 0.254: LED3.4 84.49,34.66 84.7,34.87 94.55,34.87 94.55,47.15 94.82,47.42 105.45,47.42 106.59,48.56 106.59,54.99 101.36,54.99 LED2.3
N$4
  Top 0.254: LED2.2 105.13,53.31 105.46,52.98 105.46,48.77 104.99,48.3 94.68,48.3 93.86,47.48 93.86,35.55 93.8,35.48 82.4,35.48 82.4,31.35 82.45,31.29 82.47,31.31 LED3.5
N$5  (via drill 0.35)
  Top 0.254: LED3.3 91.53,33.01 v91.67,32.87 | v53.66,16.47 53.66,12.98 LED4.4
  Bottom 0.254: v91.67,32.87 91.48,33.06 86.61,33.06 86.61,28 86.42,27.81 64.99,27.81 64.33,27.14 64.33,16.39 53.73,16.39 v53.66,16.47
N$6  (via drill 0.35)
  Top 0.254: LED4.5 53.67,11.28 v53.58,11.37 | v93.87,31.26 88.54,31.26 LED3.2
  Bottom 0.254: v53.58,11.37 53.58,15.06 65.66,15.06 65.7,15.02 65.7,26.16 65.94,26.39 90.46,26.39 90.5,26.36 90.5,31.38 93.75,31.38 v93.87,31.26
N$7  (via drill 0.35)
  Top 0.254: LED4.3 60.27,21.43 v60.28,21.44 | v26.51,32.77 26.61,32.67 LED5.4
  Bottom 0.254: v60.28,21.44 60.28,25.58 26.64,25.58 26.51,25.71 v26.51,32.77
N$8  (via drill 0.35)
  Top 0.254: LED4.2 60.33,11.22 62.4,11.22 62.4,26.78 62.36,26.81 61.25,26.81 v61.15,26.91 | v27.55,26.94 27.35,26.74 26.47,26.74 26.47,30.86 26.37,30.96 LED5.5
  Bottom 0.254: v61.15,26.91 27.58,26.91 v27.55,26.94
N$9  (via drill 0.35)
  Top 0.254: LED5.3 32.74,32.59 v34.87,32.59 | v23.56,39.72 arc90 23.59,39.75 v23.59,48.55 | v11.3,54.56 arc90 11.34,54.52 LED6.4
  Bottom 0.254: v34.87,32.59 arc90 34.91,32.63 34.91,34.11 arc90 34.89,34.13 23.53,34.13 arc90 23.56,34.16 v23.56,39.72 | v23.59,48.55 arc90 23.46,48.68 12.25,48.68 | 12.25,48.68 11.3,48.68 | v11.3,54.56 11.3,54.4 8.98,54.4 8.98,48.71 12.25,48.71 12.25,48.68
N$10  (via drill 0.35)
  Top 0.254: LED5.2 32.74,30.89 36.01,30.89 v36.01,35.93 | v19.08,44.1 16.27,44.1 16.17,44 16.17,47.96 11.4,47.96 | 11.4,47.96 11.36,47.92 | 11.4,47.96 9.73,47.96 9.73,52.79 13.7,52.79 LED6.5
  Bottom 0.254: v36.01,35.93 28.33,35.93 28.3,35.96 28.3,41.78 28.04,42.04 19.18,42.04 19.08,42.14 v19.08,44.1
N$11
  Top 0.254: LED7.4 10.3,78.38 10.32,56.95 17.71,56.94 LED6.3
N$12
  Top 0.254: LED7.5 11.6,76.63 11.6,58.08 20.26,58.08 20.26,52.81 LED6.2
N$13  (via drill 0.35)
  Top 0.254: LED8.4 53.38,121.3 53.38,120.28 52.86,120.28 52.86,120.2 52.7,120.04 52.7,117.55 51.68,117.55 51.68,102.34 v43.01,102.34 | v19.12,78.37 LED7.3
  Bottom 0.254: v43.01,102.34 43.01,96.05 39.61,96.05 39.61,78.37 v19.12,78.37
N$14  (via drill 0.35)
  Top 0.254: LED7.2 v40.04,76.67 | 55.47,119.59 LED8.5 53.3,119.59 v53.3,116.03
  Bottom 0.254: v40.04,76.67 40.04,95.45 44.2,95.45 44.2,102.17 53.38,102.17 v53.3,116.03
N$15
  Bottom 0.254: ESP12E.D1 56.4,67.88 56.44,67.83 56.44,57.03 56.35,56.95 59.67,56.95 59.84,56.78 59.8,56.74 JP1.3
N$16  (via drill 0.35)
  Top 0.254: 101.34,51.68 LED2.1 103.92,51.65 103.96,51.68 v103.96,49.55 | LED6.1 20.6,51.12 20.73,51.24 | 20.09,58.48 20.25,58.48 20.43,58.48 20.73,58.19 20.73,51.24 | 20.09,58.48 | 20.09,58.48 17.58,58.48 17.57,58.49 LED7.1 41.31,74.97 41.31,100.22 45.39,100.22 45.39,100.89 ESP12E.3V3@2 | v57.85,106.91 57.95,107.02 60.14,107.02 60.14,117.84 LED8.1 | LED5.1 55.45,29.27 v55.51,29.32 63.92,29.32 63.92,25.67 64,25.58 | 64,25.58 88.49,25.58 88.49,25.59 LED3.1 95.34,29.61 95.37,29.58 95.46,29.66 95.46,45.73 95.62,45.9 v101.66,45.9 | LED4.1 63.95,9.58 64,9.52 64,25.58 | LED1.1 104.03,76.23 v104.04,76.25 | 20.73,51.24 28.65,51.25 v28.65,45.56 28.65,45.48 | v41.82,45.48 v54.74,45.48
  Bottom 0.254: ESP12E.3V3@2 57.8,100.89 57.88,100.81 57.88,106.88 v57.85,106.91 | v55.51,29.32 55.51,43.35 54.74,44.12 v54.74,45.48 54.74,53.11 JP1.1 | v101.66,45.9 101.75,45.98 101.75,49.55 v103.96,49.55 104.04,49.64 v104.04,76.25 | v28.65,45.56 v41.82,45.48
N$17
  Bottom 0.254: ESP12E.D2 57.41,70.41 57.46,70.47 57.46,58.05 57.8,57.71 62.39,57.71 62.39,53.17 JP1.4
N$19  (via drill 0.35)
  Top 0.254: v75.11,56.01 75.11,71.1 91.94,71.1 91.94,79.62 91.96,79.65 97.51,79.65 LED1.4
  Bottom 0.254: v75.11,56.01 75.18,56.01 75.18,49.86 66.46,49.86 66.46,85.59 66.47,85.59 66.41,85.66 ESP12E.D6
N$20  (via drill 0.35)
  Top 0.254: v64.52,83.13 65.79,81.86 v71.62,81.86 71.74,81.86 | v94.94,77.94 LED1.5
  Bottom 0.254: ESP12E.D5 64.5,83.11 v64.52,83.13 | v71.62,81.86 94.94,81.86 v94.94,77.94
N$22
  Top 0.254: S1.2 S1.1 39.52,46.84 44.8,46.84 44.8,72.93 ESP12E.D3
N$23  (via drill 0.35)
  Top 0.254: S2.2 S2.1 | v42.67,49.21 42.67,75.48 ESP12E.D4
  Bottom 0.254: S2.1 42.67,38.5 v42.67,49.21
N$24  (via drill 0.35)
  Top 0.254: S3.2 S3.1 | v58.31,69.95 58.23,88.23 47.02,88.23 ESP12E.D7
  Bottom 0.254: S3.2 66.06,48.99 65.98,59.74 59.96,59.75 59.96,69.75 59.84,69.87 58.23,69.87 v58.31,69.95
N$25  (via drill 0.35)
  Top 0.254: S4.2 S4.1 | v58.99,67.59 58.99,95.79 58.97,95.81 ESP12E.TX
  Bottom 0.254: S4.2 64.96,38.52 64.96,58.76 58.96,58.79 v58.99,67.59
N$27
  Bottom 0.254: PWR.P1 98.6,62.56 98.6,83.05 74.8,83.05 74.88,100.89 ESP12E.VIN